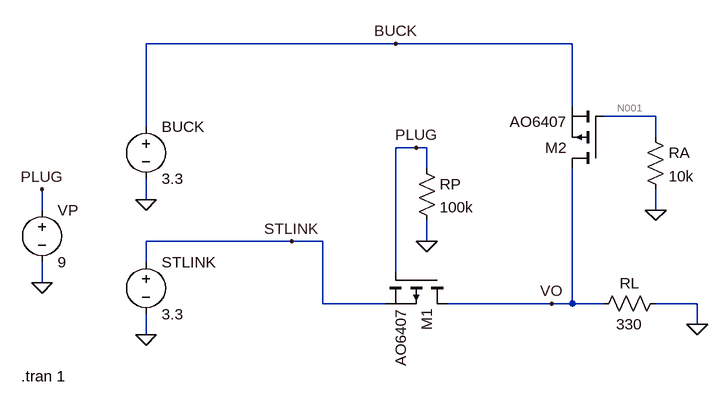
[diagram p0: schematic A1.asc]
A1.asc, the LTspice schematic file:
Version 4
SHEET 1 932 680
WIRE 448 -64 64 -64
WIRE 720 -64 448 -64
WIRE 720 32 720 -64
WIRE 848 48 768 48
WIRE 64 64 64 -64
WIRE 848 80 848 48
WIRE 480 96 448 96
WIRE 496 96 480 96
WIRE 496 128 496 96
WIRE 64 176 64 144
WIRE -96 192 -96 160
WIRE 848 192 848 160
WIRE 288 240 64 240
WIRE 336 240 288 240
WIRE 496 240 496 208
WIRE 64 272 64 240
WIRE 448 288 448 96
WIRE -96 304 -96 272
WIRE 336 336 336 240
WIRE 432 336 336 336
WIRE 688 336 528 336
WIRE 720 336 720 128
WIRE 720 336 688 336
WIRE 768 336 720 336
WIRE 912 336 848 336
WIRE 912 368 912 336
WIRE 64 384 64 352
FLAG -96 304 0
FLAG 64 384 0
FLAG 64 176 0
FLAG 912 368 0
FLAG -96 160 PLUG
FLAG 496 240 0
FLAG 480 96 PLUG
FLAG 848 192 0
FLAG 688 336 VO
FLAG 448 -64 BUCK
FLAG 288 240 STLINK
SYMBOL voltage 64 48 R0
WINDOW 123 0 0 Left 0
WINDOW 39 0 0 Left 0
SYMATTR InstName BUCK
SYMATTR Value 3.3
SYMBOL voltage 64 256 R0
WINDOW 123 0 0 Left 0
WINDOW 39 0 0 Left 0
SYMATTR InstName STLINK
SYMATTR Value 3.3
SYMBOL voltage -96 176 R0
WINDOW 123 0 0 Left 0
WINDOW 39 0 0 Left 0
SYMATTR InstName VP
SYMATTR Value 9
SYMBOL pmos 528 288 R90
SYMATTR InstName M1
SYMATTR Value AO6407
SYMBOL pmos 768 128 R180
SYMATTR InstName M2
SYMATTR Value AO6407
SYMBOL res 864 320 R90
WINDOW 0 0 56 VBottom 2
WINDOW 3 32 56 VTop 2
SYMATTR InstName RL
SYMATTR Value 330
SYMBOL res 480 112 R0
SYMATTR InstName RP
SYMATTR Value 100k
SYMBOL res 832 64 R0
SYMATTR InstName RA
SYMATTR Value 10k
TEXT -128 448 Left 2 !.tran 1

The netlist it stands for:
* A1.asc
V§BUCK BUCK 0 3.3
V§STLINK STLINK 0 3.3
VP PLUG 0 9
M1 VO PLUG STLINK STLINK AO6407
M2 VO N001 BUCK BUCK AO6407
RL 0 VO 330
RP PLUG 0 100k
RA N001 0 10k
.model NMOS NMOS
.model PMOS PMOS
.lib standard.mos
.tran 1
.backanno
.end

* Results of the author's LTspice run, read from the files saved beside the schematic
* Operating Point, zero values left out:
*   V(buck) = 3.3 V
*   V(stlink) = 3.3 V
*   V(plug) = 9 V
*   V(vo) = 3.3 V
*   Id(M2) = -9.999 mA
*   Is(M2) = 9.999 mA
*   I(Rl) = -9.999 mA
*   I(Rp) = 90 µA
*   I(Buck) = -9.999 mA
*   I(Vp) = -90 µA
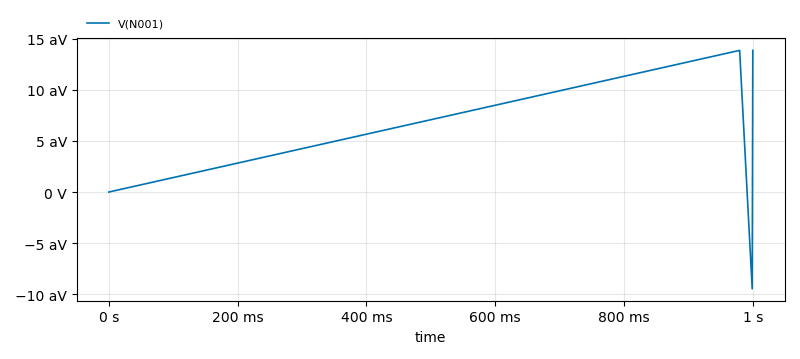
[diagram p1: Transient Analysis of A1.asc, plotted from the saved traces]
* Transient Analysis, 1 run:
*   V(N001): min -0.009476 fV, max 0.01387 fV, average 0.00684 fV, rms 0.009857 fV, last 0.01387 fV